# Altium schematic sheet DWM1000.SchDoc
size A
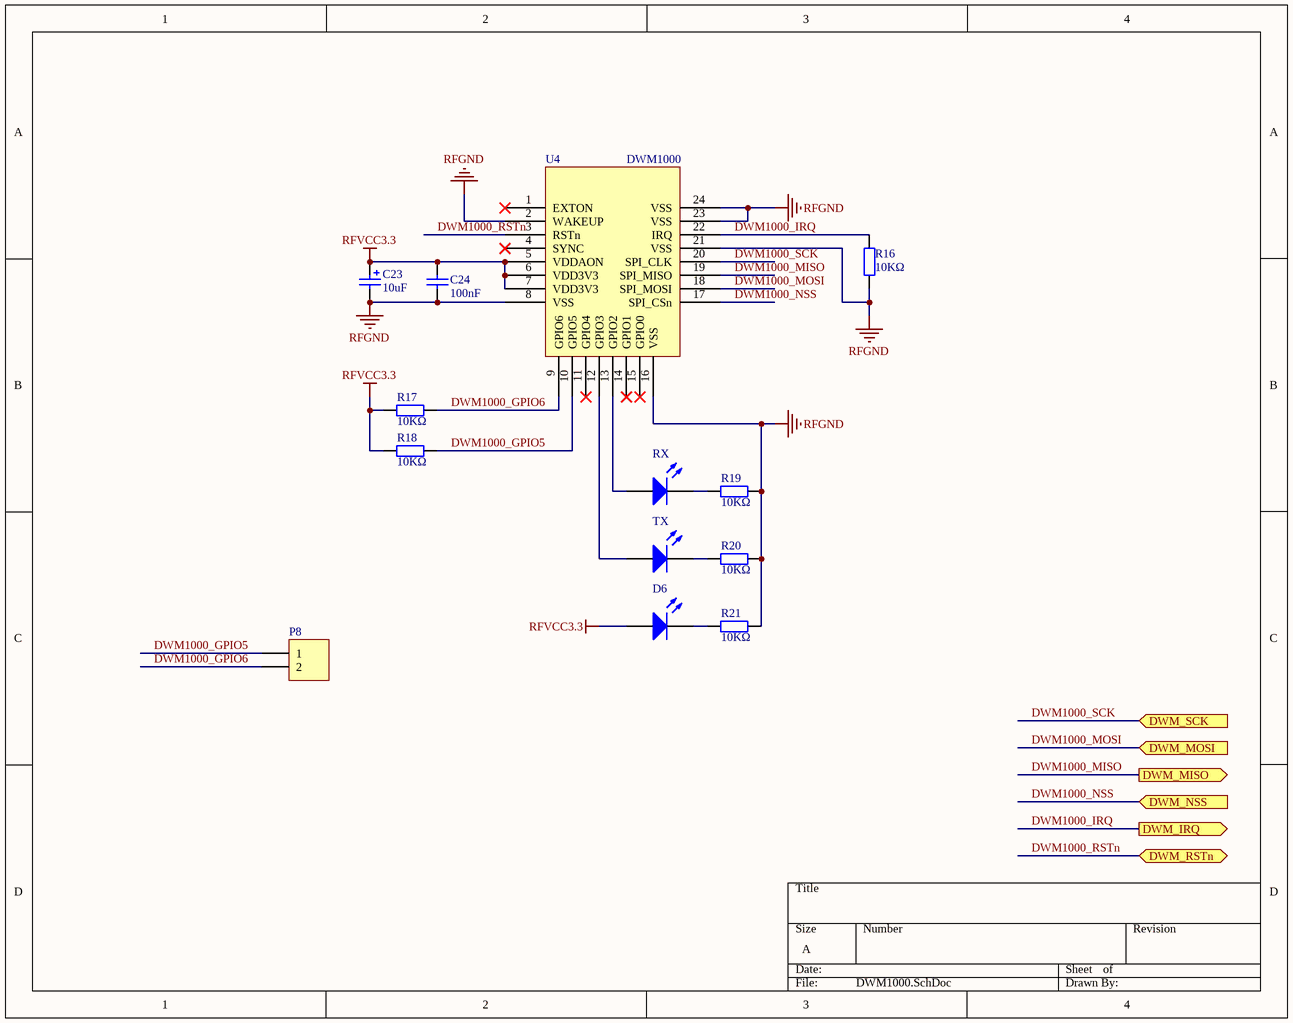
[diagram p0: DWM1000.SchDoc]

## Parts
C23  10uF  [CASE-A_3216]
C24  100nF  [0603_C]
D6  蓝灯 0805  [0805_LED_S1]  (value not drawn)
P8  Header 2  [HDR1X2]  (value not drawn)
R16  10KΩ  [0603_R]
R17  10KΩ  [0603_R]
R18  10KΩ  [0603_R]
R19  10KΩ  [0603_R]
R20  10KΩ  [0603_R]
R21  10KΩ  [0603_R]
RX  蓝灯 0805  [0805_LED_S1]  (value not drawn)
TX  蓝灯 0805  [0805_LED_S1]  (value not drawn)
U4  DWM1000  [DWM1000]

## Ports
DWM_IRQ (out), DWM_MISO (out), DWM_MOSI (in), DWM_NSS (in), DWM_RSTn (bidir), DWM_SCK (in)

## Nets
RFGND: C23.2 C24.1 R16.1 R19.1 R20.1 R21.1 U4.2(WAKEUP) U4.8(VSS) U4.16(VSS) U4.21(VSS) U4.23(VSS) U4.24(VSS)
RFVCC3.3: C23.1 C24.2 D6.A R17.2 R18.2 U4.5(VDDAON) U4.6(VDD3V3) U4.7(VDD3V3)
DWM1000_GPIO5: P8.1 R18.1 U4.10(GPIO5)
DWM1000_GPIO6: P8.2 R17.1 U4.9(GPIO6)
DWM1000_IRQ: R16.2 U4.22(IRQ) ; port DWM_IRQ
DWM1000_MISO: U4.19(SPI_MISO) ; port DWM_MISO
DWM1000_MOSI: U4.18(SPI_MOSI) ; port DWM_MOSI
DWM1000_NSS: U4.17(SPI_CSn) ; port DWM_NSS
DWM1000_RSTn: U4.3(RSTn) ; port DWM_RSTn
DWM1000_SCK: U4.20(SPI_CLK) ; port DWM_SCK
NetD6_K: D6.K R21.2
NetR19_2: R19.2 RX.K
NetR20_2: R20.2 TX.K
NetRX_A: RX.A U4.13(GPIO2)
NetTX_A: TX.A U4.12(GPIO3)

Not connected (* = marked no-connect by the designer): U4 1(EXTON)* 4(SYNC)* 11(GPIO4)* 14(GPIO1)* 15(GPIO0)*

## Library data of the parts
C23 = 3216 10uF (106) 10% 16V: 钽电容; ComponentLink1Description: 供应商链接; ComponentLink1URL: http://www.szlcsc.com/product/details_7643.html; Package: 3216; Supplier: LC; SuppliersPartNumber: C7171
C24 = 0603 100nF (104) 10% 50V: 贴片电容; ComponentLink1Description: 供应商链接; ComponentLink1URL: http://www.szlcsc.com/product/details_15331.html; Package: 0603; Supplier: LC; SuppliersPartNumber: C14663
D6 RX TX = 0805 蓝灯: 发光二极管; ComponentLink1Description: 供应商链接; ComponentLink1URL: http://www.szlcsc.com/product/details_2666.html; Package: 0805; Supplier: LC; SuppliersPartNumber: C2293
P8 = Header 2: Header, 2-Pin; LatestRevisionDate: 17-Jul-2002; LatestRevisionNote: Re-released for DXP Platform.; Publisher: Altium Limited
R16-R21 = 0603 10KΩ (1002) 1%: 贴片电阻; ComponentLink1Description: 供应商链接; ComponentLink1URL: http://www.szlcsc.com/product/details_26547.html; Package: 0603; Supplier: LC; SuppliersPartNumber: C25804